# Altium schematic sheet v1.5 Flash & Buzzer.SchDoc
size A4; DocumentNumber: 5; SheetNumber: 5
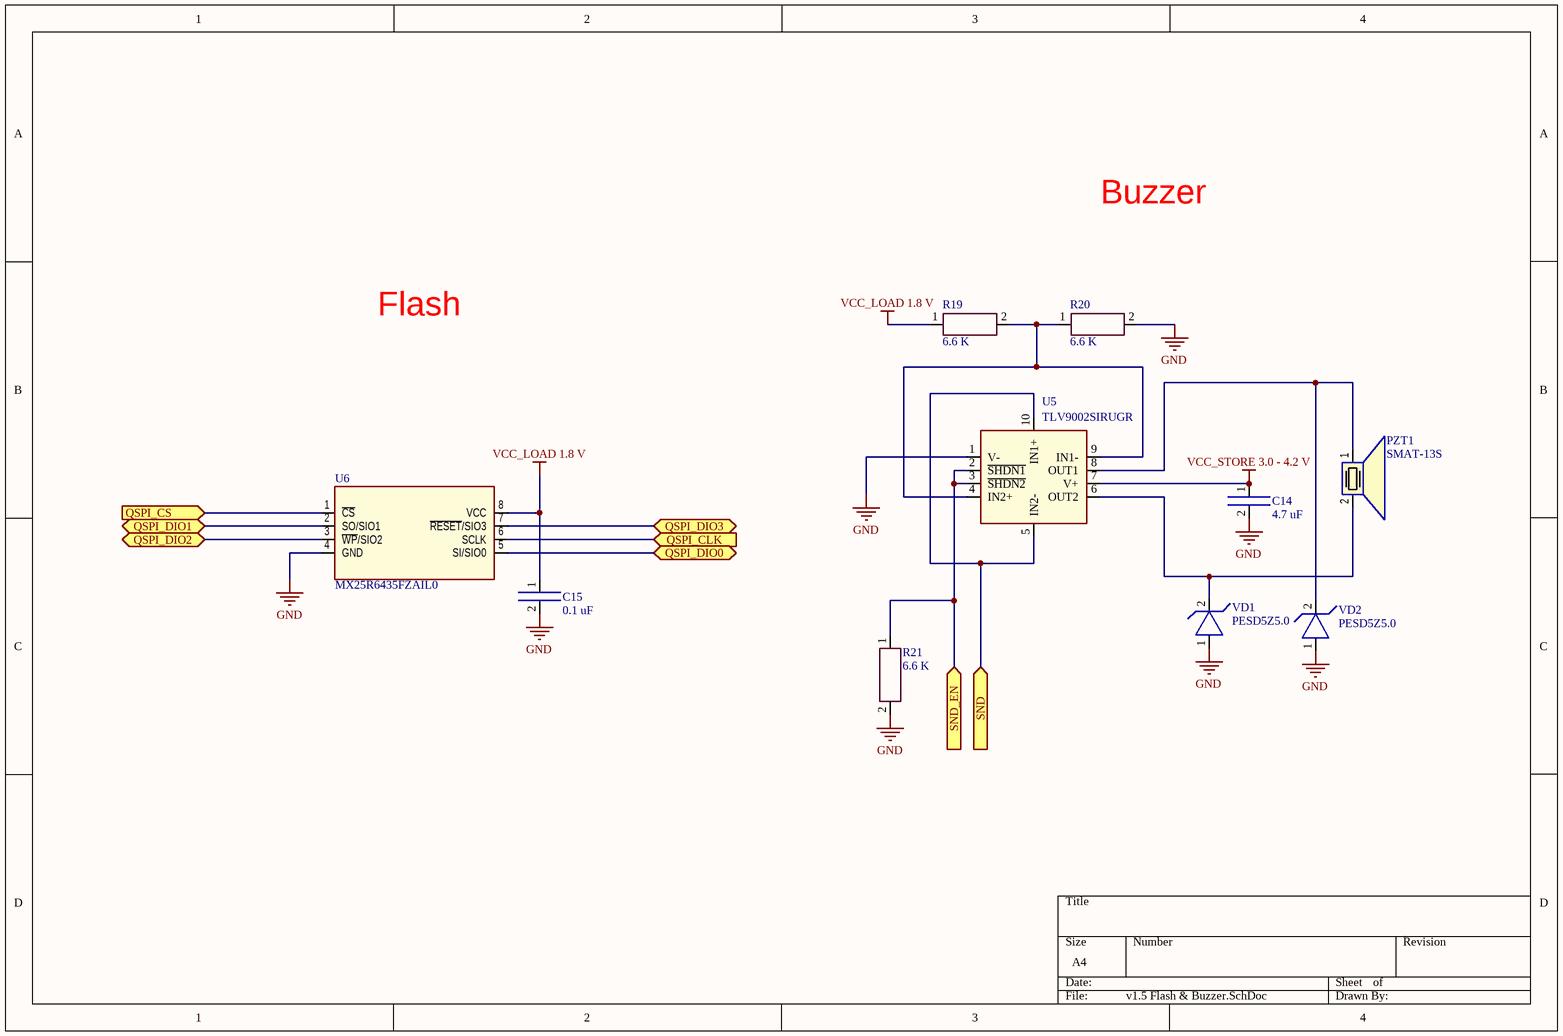
[diagram p0: v1.5 Flash & Buzzer.SchDoc]

## Parts
C14  4.7 uF  [0402]
C15  0.1 uF  [0402]
PZT1  SMAT-13S  [SMAT-13-mount by wire]  (no BOM)
R19  6.6 K  [0402]
R20  6.6 K  [0402]
R21  6.6 K  [0402]
U5  TLV9002SIRUGR  [X2QFN]
U6  MX25R6435FZAIL0  [MX25R6435F-ZA]
VD1  PESD5Z5.0  [SOD-523]
VD2  PESD5Z5.0  [SOD-523]

## Ports
QSPI_CLK (in), QSPI_CS (in), QSPI_DIO0 (bidir), QSPI_DIO1 (bidir), QSPI_DIO2 (bidir), QSPI_DIO3 (bidir), SND (in), SND_EN (in)

## Nets
GND: C14.2 C15.2 R20.2 R21.2 U5.1(V-) U6.4(GND) VD1.1 VD2.1
VCC_LOAD 1.8 V: C15.1 R19.1 U6.8(VCC)
VCC_STORE 3.0 - 4.2 V: C14.1 U5.7(V+)
QSPI_CLK: U6.6(SCLK) ; port QSPI_CLK
QSPI_CS: U6.1(~{CS}) ; port QSPI_CS
QSPI_DIO0: U6.5(SI/SIO0) ; port QSPI_DIO0
QSPI_DIO1: U6.2(SO/SIO1) ; port QSPI_DIO1
QSPI_DIO2: U6.3(~{WP}/SIO2) ; port QSPI_DIO2
QSPI_DIO3: U6.7(~{RESET}/SIO3) ; port QSPI_DIO3
SND: U5.5(IN2-) U5.10(IN1+) ; port SND
SND_EN: R21.1 U5.2(~{SHDN1}) U5.3(~{SHDN2}) ; port SND_EN
NetPZT1_1: PZT1.1 U5.8(OUT1) VD2.2
NetPZT1_2: PZT1.2 U5.6(OUT2) VD1.2
NetR19_2: R19.2 R20.1 U5.4(IN2+) U5.9(IN1-)

## Notes on the sheet
- Buzzer
- Flash

## Library data of the parts
C14 C15 = Capasistor
PZT1 = Piezo transducer
R19-R21 = Resistor
U5 = TLV9002S
U6 = MX25R6435F-ZA
VD1 VD2 = Stabilitron